# EAGLE design Visualizer Bar (EAGLE 9.6.2)
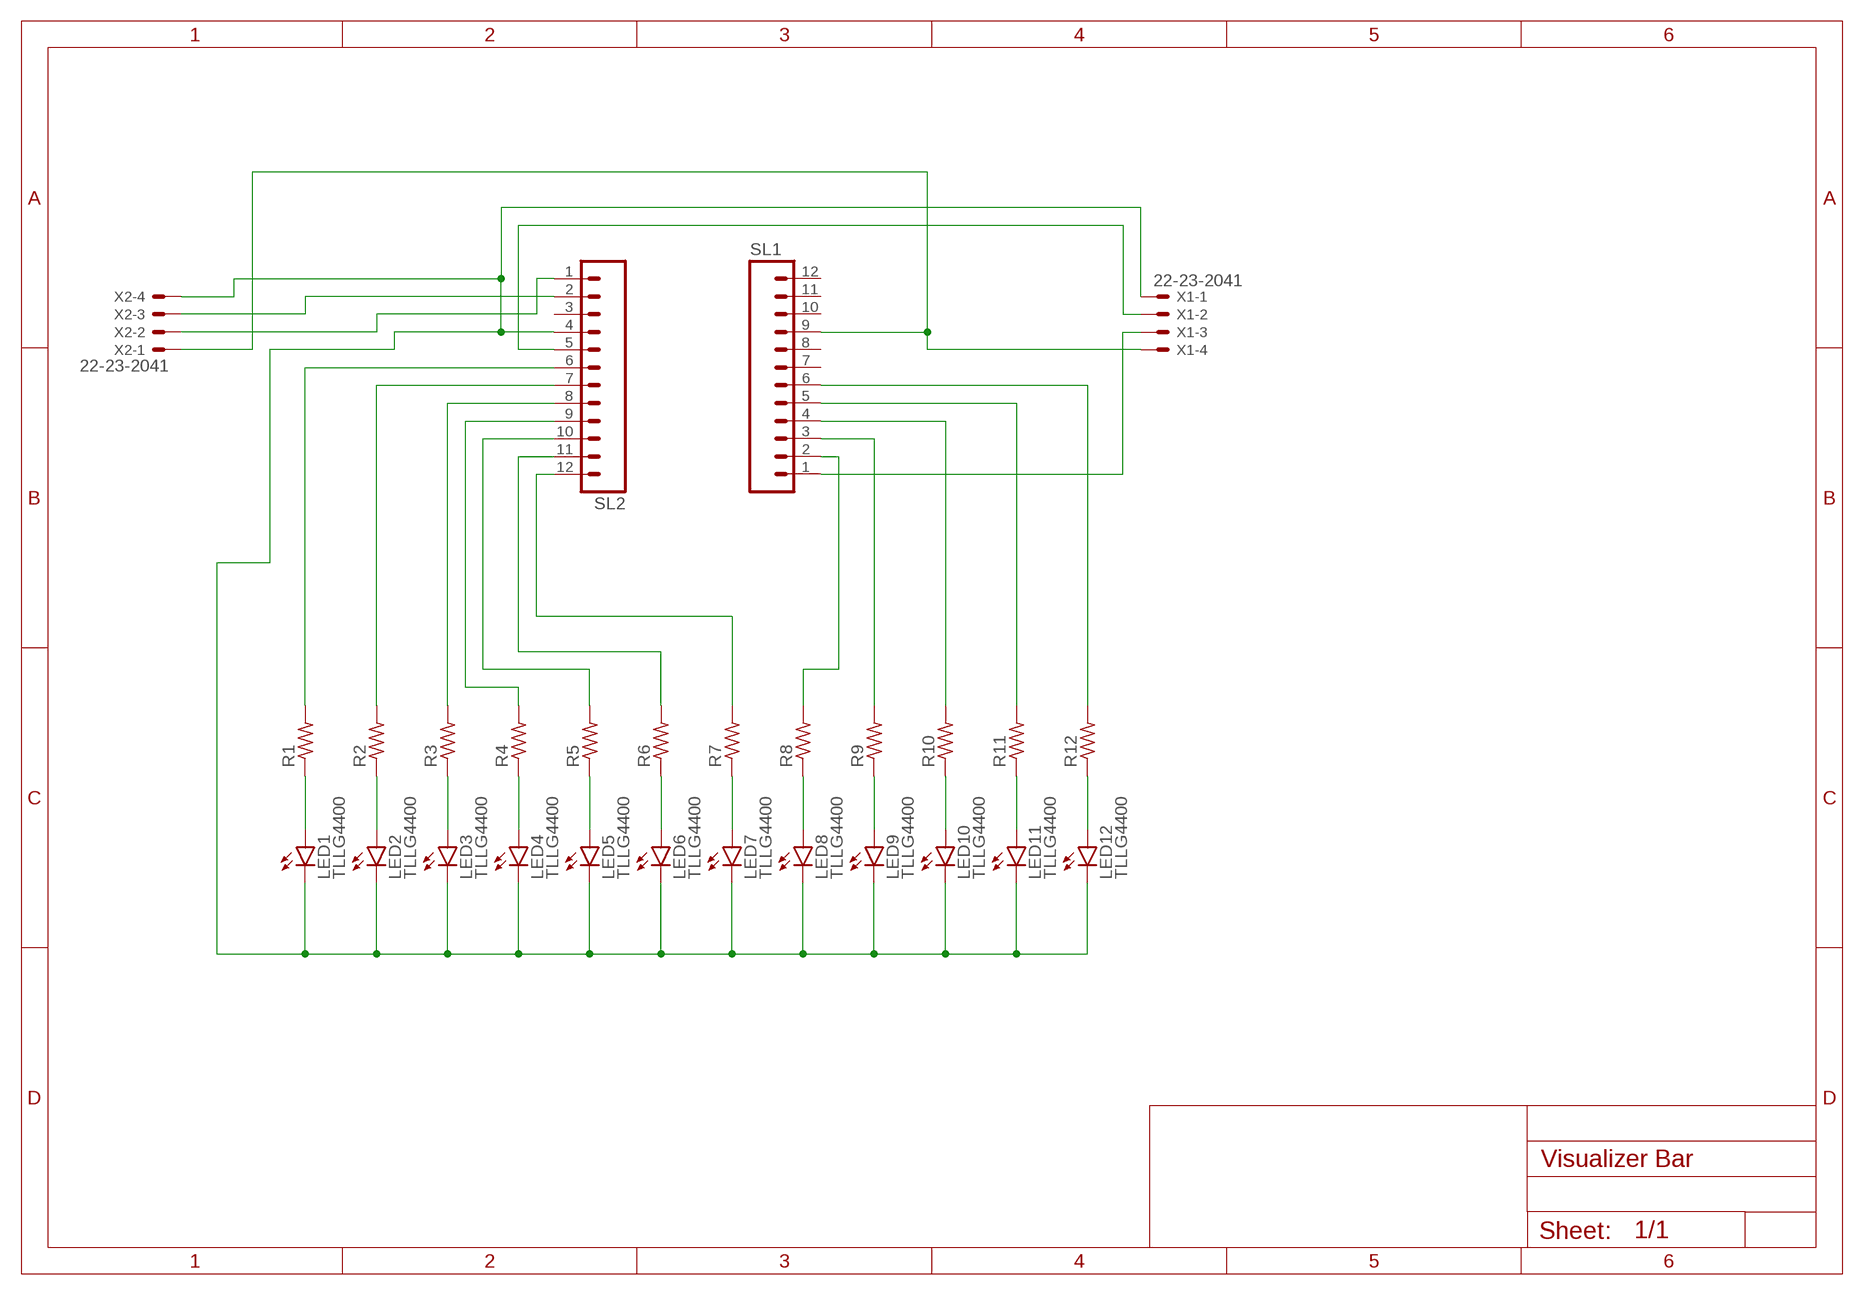
[diagram p0: schematic, sheet 1]

## Parts
LED1  TLLG4400  [LED3MM]
LED2  TLLG4400  [LED3MM]
LED3  TLLG4400  [LED3MM]
LED4  TLLG4400  [LED3MM]
LED5  TLLG4400  [LED3MM]
LED6  TLLG4400  [LED3MM]
LED7  TLLG4400  [LED3MM]
LED8  TLLG4400  [LED3MM]
LED9  TLLG4400  [LED3MM]
LED10  TLLG4400  [LED3MM]
LED11  TLLG4400  [LED3MM]
LED12  TLLG4400  [LED3MM]
R1  R-US_0204/5  [0204/5]
R2  R-US_0204/5  [0204/5]
R3  R-US_0204/5  [0204/5]
R4  R-US_0204/5  [0204/5]
R5  R-US_0204/5  [0204/5]
R6  R-US_0204/5  [0204/5]
R7  R-US_0204/5  [0204/5]
R8  R-US_0204/5  [0204/5]
R9  R-US_0204/5  [0204/5]
R10  R-US_0204/5  [0204/5]
R11  R-US_0204/5  [0204/5]
R12  R-US_0204/5  [0204/5]
SL1  M12  [12P]
SL2  M12  [12P]
X1  22-23-2041  [22-23-2041]
X2  22-23-2041  [22-23-2041]

## Nets
N$1: R6.2 SL2.11
N$2: R4.2 SL2.9
N$3: R3.2 SL2.8
N$4: R5.2 SL2.10
N$5: R2.2 SL2.7
N$6: SL1.1 X1.3
N$7: R12.2 SL1.6
N$8: R11.2 SL1.5
N$9: R10.2 SL1.4
N$10: R9.2 SL1.3
N$11: R8.2 SL1.2
N$12: R7.2 SL2.12
N$13: LED1.A R1.1
N$14: LED2.A R2.1
N$15: LED3.A R3.1
N$16: LED4.A R4.1
N$17: LED5.A R5.1
N$18: LED6.A R6.1
N$19: LED7.A R7.1
N$20: LED8.A R8.1
N$21: LED9.A R9.1
N$22: LED10.A R10.1
N$23: LED11.A R11.1
N$24: LED12.A R12.1
N$25: R1.2 SL2.6
N$26: SL2.5 X1.2
N$27: LED1.K(C) LED2.K(C) LED3.K(C) LED4.K(C) LED5.K(C) LED6.K(C) LED7.K(C) LED8.K(C) LED9.K(C) LED10.K(C) LED11.K(C) LED12.K(C) SL2.4 X1.1 X2.4
N$28: SL1.9 X1.4 X2.1
N$30: SL2.2 X2.3
N$31: SL2.1 X2.2
Unconnected: SL1.7 SL1.8 SL1.10 SL1.11 SL1.12 SL2.3

## Library data of the parts
LED1-LED12 = led:TLLG4400: Low Current (2mA) LED 3 mm Tinted Diffused Package color GREEN Source: Data sheet <http://www.farnell.com/datasheets/391098.pdf>; MF: VISHAY SEMICONDUCTOR; OC_FARNELL: 1612435
R1-R12 = resistor:R-US_: RESISTOR, American symbol
SL1 SL2 = con-amp-quick:M12: AMP QUICK CONNECTOR; OC_FARNELL: unknown; OC_NEWARK: unknown
X1 X2 = con-molex:22-23-2041: .100" (2.54mm) Center Header - 4 Pin; MF: MOLEX; MPN: 22-23-2041; OC_FARNELL: 1462920; OC_NEWARK: 38C0355

## Board
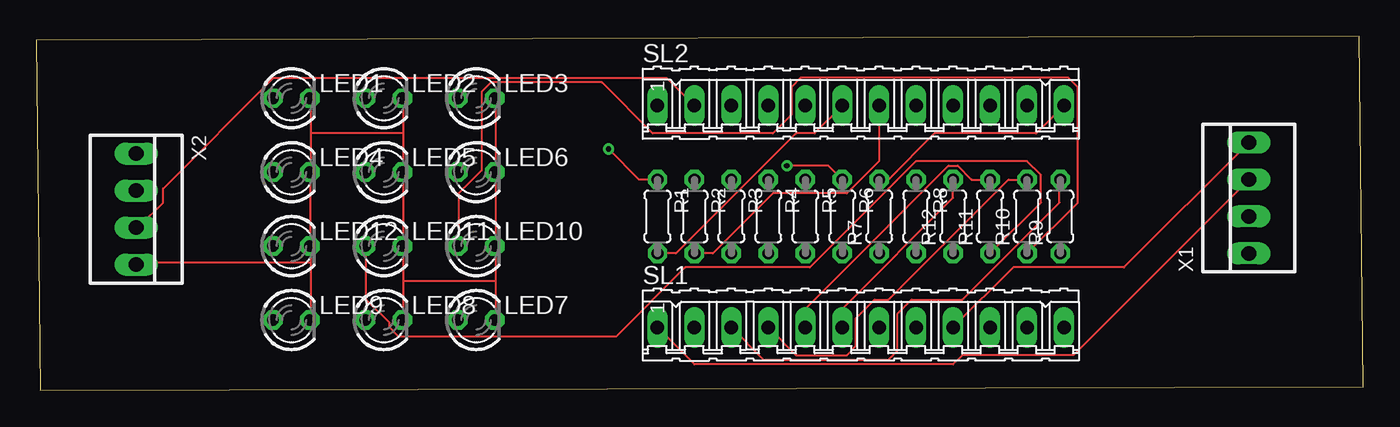
[diagram p1: board, top side]
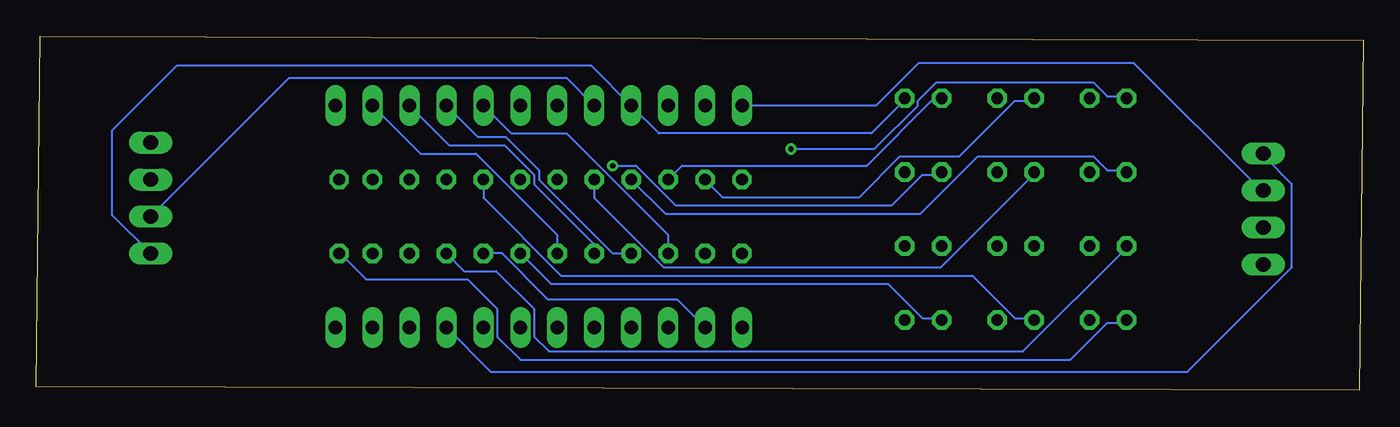
[diagram p2: board, bottom side, seen from below]

Size 91.17 x 24.31 mm. Coordinates in mm from the lower left corner, seen from the top.
Outline: 0.25,0 91.17,0.25 90.91,24.31 0,24.05 0.25,0
Copper layers (1*16): Top 0.035mm / dielectric 1.5mm / Bottom 0.035mm
Design rules "default": minimum track width 6mil, minimum drill 0.35mm, track to track 6mil, track to pad 6mil, pad to pad 6mil, via to via 6mil, smd to smd 6mil, copper to edge 40mil, drill to drill 6mil, minimum pad ring 10mil, minimum via ring 8mil, stop-mask expansion 4mil, vias tented up to drill 0mil, thermal gap 10mil

### Footprints (pad centres in the part's own frame; a part is rotated, then mirrored left to right if it is on the bottom)
LED3MM = drill 0.813 octagon: A -1.27,0; K 1.27,0
0204/5 = drill 0.813 octagon: 1 -2.54,0; 2 2.54,0
12P = drill 0.914 long: 1 -13.97,0; 2 -11.43,0; 3 -8.89,0; 4 -6.35,0; 5 -3.81,0; 6 -1.27,0; 7 1.27,0; 8 3.81,0; 9 6.35,0; 10 8.89,0; 11 11.43,0; 12 13.97,0
22-23-2041 = drill 1 long: 1 -3.81,0; 2 -1.27,0; 3 1.27,0; 4 3.81,0

### Placement (x,y rotation side)
LED1  17.53,20.07 0 top
LED2  23.88,20.07 0 top
LED3  30.23,20.07 0 top
LED4  17.53,14.99 0 top
LED5  23.88,14.99 0 top
LED6  30.23,14.99 0 top
LED7  30.23,4.83 0 top
LED8  23.88,4.83 0 top
LED9  17.53,4.83 0 top
LED10  30.23,9.91 0 top
LED11  23.88,9.91 0 top
LED12  17.53,9.91 0 top
R1  42.67,11.94 270 top
R2  45.21,11.94 270 top
R3  47.75,11.94 270 top
R4  50.29,11.94 270 top
R5  52.83,11.94 270 top
R6  55.37,11.94 270 top
R7  57.91,11.94 90 top
R8  60.45,11.94 270 top
R9  70.36,11.94 90 top
R10  68.07,11.94 90 top
R11  65.53,11.94 90 top
R12  62.99,11.94 90 top
SL1  56.64,4.32 0 top
SL2  56.64,19.56 0 top
X1  83.31,13.21 90 top
X2  6.86,12.45 270 top

### Tracks (layer width: path | path; a pad name or v marks a point on that pad's centre or on a via)
N$1
  Bottom 0.152: R6.2 55.37,10.67 60.96,16.26 64.77,16.26 SL2.11
N$2
  Bottom 0.152: R4.2 51.56,9.4 56.64,14.48 56.64,15.11 58.93,17.4 60.83,17.4 SL2.9
N$3
  Bottom 0.152: R3.2 47.75,10.67 54.74,17.65 58.55,17.65 SL2.8
N$4
  Bottom 0.152: R5.2 52.83,10.03 56.96,14.16 56.96,14.8 58.99,16.83 62.8,16.83 SL2.10
N$5
  Top 0.152: R2.2 46.48,9.4 50.61,13.53 55.69,13.53 57.91,15.75 SL2.7
N$6
  Top 0.152: SL1.1 45.21,1.78 62.99,1.78 63.63,2.41 71.25,2.41 X1.3
N$7
  Top 0.152: R12.2 62.99,13.21 55.37,5.59 SL1.6
N$8
  Top 0.152: R11.2 64.26,14.48 63.31,15.43 62.67,15.43 52.83,5.59 SL1.5
N$9
  Top 0.152: R10.2 66.8,14.48 58.55,6.22 57.59,6.22 56.32,4.95 56.32,3.05 55.69,2.41 52.2,2.41 SL1.4
N$10
  Top 0.152: SL1.3 49.97,2.1 58.55,2.1 59.18,2.73 59.18,5.27 60.13,6.22 63.63,6.22 70.29,12.89 70.29,14.48 R9.2
N$11
  Bottom 0.152: R8.2 59.18,9.4 56.01,6.22 47.12,6.22 SL1.2
N$12
  Top 0.152: R7.2 58.55,14.48 61.72,17.65 68.71,17.65 SL2.12
N$13  (via drill 0.35)
  Top 0.152: R1.1 41.4,14.48 v39.31,16.57
  Bottom 0.152: v39.31,16.57 33.59,16.57 30.61,19.56 30.61,19.88 29.34,21.14 18.54,21.14 17.59,20.19 16.32,20.19 LED1.A
N$14
  Bottom 0.152: R2.1 44.01,13.27 34.61,13.27 31.81,16.07 27.75,16.07 23.94,19.88 22.67,19.88 LED2.A
N$15
  Bottom 0.152: R3.1 46.8,15.43 34.1,15.43 29.66,19.88 29.02,19.88 LED3.A
N$16
  Bottom 0.152: R4.1 47.94,12.13 30.42,12.13 26.48,16.07 18.54,16.07 17.59,15.11 16.32,15.11 LED4.A
N$17
  Bottom 0.152: R5.1 52.83,13.21 48.07,8.45 29.02,8.45 22.67,14.8 LED5.A
N$18  (via drill 0.35)
  Top 0.152: v51.56,15.43 54.42,15.43 R6.1
  Bottom 0.152: v51.56,15.43 49.97,15.43 47.24,12.7 32.38,12.7 30.29,14.8 29.02,14.8 LED6.A
N$19
  Bottom 0.152: R7.1 55.82,7.3 32.64,7.3 30.29,4.95 29.02,4.95 LED7.A
N$20
  Bottom 0.152: R8.1 60.45,13.21 55.12,7.87 26.86,7.87 23.94,4.95 22.67,4.95 LED8.A
N$21
  Bottom 0.152: LED9.A 16.32,4.64 17.59,4.64 20.13,2.1 57.91,2.1 59.5,3.68 59.5,5.59 61.53,7.62 68.52,7.62 70.29,9.4 R9.1
N$22
  Top 0.152: R10.1 71.57,12.89 71.57,20.83 70.93,21.46 52.52,21.46 51.88,20.83 51.88,18.92 50.61,17.65 42.35,17.65 38.86,21.14 31.24,21.14 30.61,20.51 30.61,15.11 29.02,13.53 29.02,10.03 LED10.A
N$23
  Top 0.152: R11.1 69.02,12.89 69.02,14.8 68.07,15.75 60.45,15.75 53.15,8.45 44.58,8.45 39.81,3.68 24.89,3.68 24.26,4.32 24.26,4.64 22.67,6.22 22.67,9.72 LED11.A
N$24
  Bottom 0.152: R12.1 61.79,8.19 59.56,8.19 56.96,5.59 56.96,3.68 55.94,2.67 23.37,2.67 16.32,9.72 LED12.A
N$25
  Top 0.152: R1.2 43.94,9.4 52.2,17.65 53.47,17.65 SL2.6
N$26
  Bottom 0.152: SL2.5 54.74,21.46 73.79,21.46 X1.2
N$27
  Top 0.152: 18.86,17.65 18.86,19.88 LED1.K | 18.86,17.65 18.86,15.11 LED4.K 18.86,14.8 18.86,10.03 LED12.K 18.86,9.72 18.86,8.76 | 18.86,8.76 18.86,4.95 LED9.K | 18.86,8.76 7.11,8.76 X2.4 | 25.21,7.49 25.21,9.72 LED11.K 25.21,10.03 25.21,14.8 LED5.K 25.21,15.11 25.21,17.65 | 25.21,7.49 25.21,4.95 LED8.K | 25.21,17.65 25.21,19.88 LED2.K | 31.56,7.49 31.56,9.72 LED10.K 31.56,10.03 31.56,14.8 LED6.K 31.56,15.11 31.56,19.88 LED3.K | 31.56,7.49 31.56,4.95 LED7.K | 31.56,7.49 25.21,7.49 | 25.21,17.65 18.86,17.65
  Bottom 0.152: LED3.K 31.56,19.88 33.78,17.65 48.39,17.65 SL2.4 53.02,22.29 81.53,22.29 85.98,17.84 85.98,12.06 X1.1
N$28
  Top 0.152: SL1.9 67.12,8.45 74.74,8.45 X1.4
  Bottom 0.152: SL1.9 59.94,1.27 12.06,1.27 4.89,8.45 4.89,14.16 6.79,16.07 X2.1
N$30
  Top 0.152: SL2.2 43.31,21.46 16.32,21.46 8.7,13.84 8.7,12.89 7.11,11.3 X2.3
N$31
  Bottom 0.152: SL2.1 33.46,19.56 30.54,22.48 15.75,22.48 7.11,13.84 X2.2